# EAGLE design payload-section-B-1.1 (EAGLE 9.2.2)
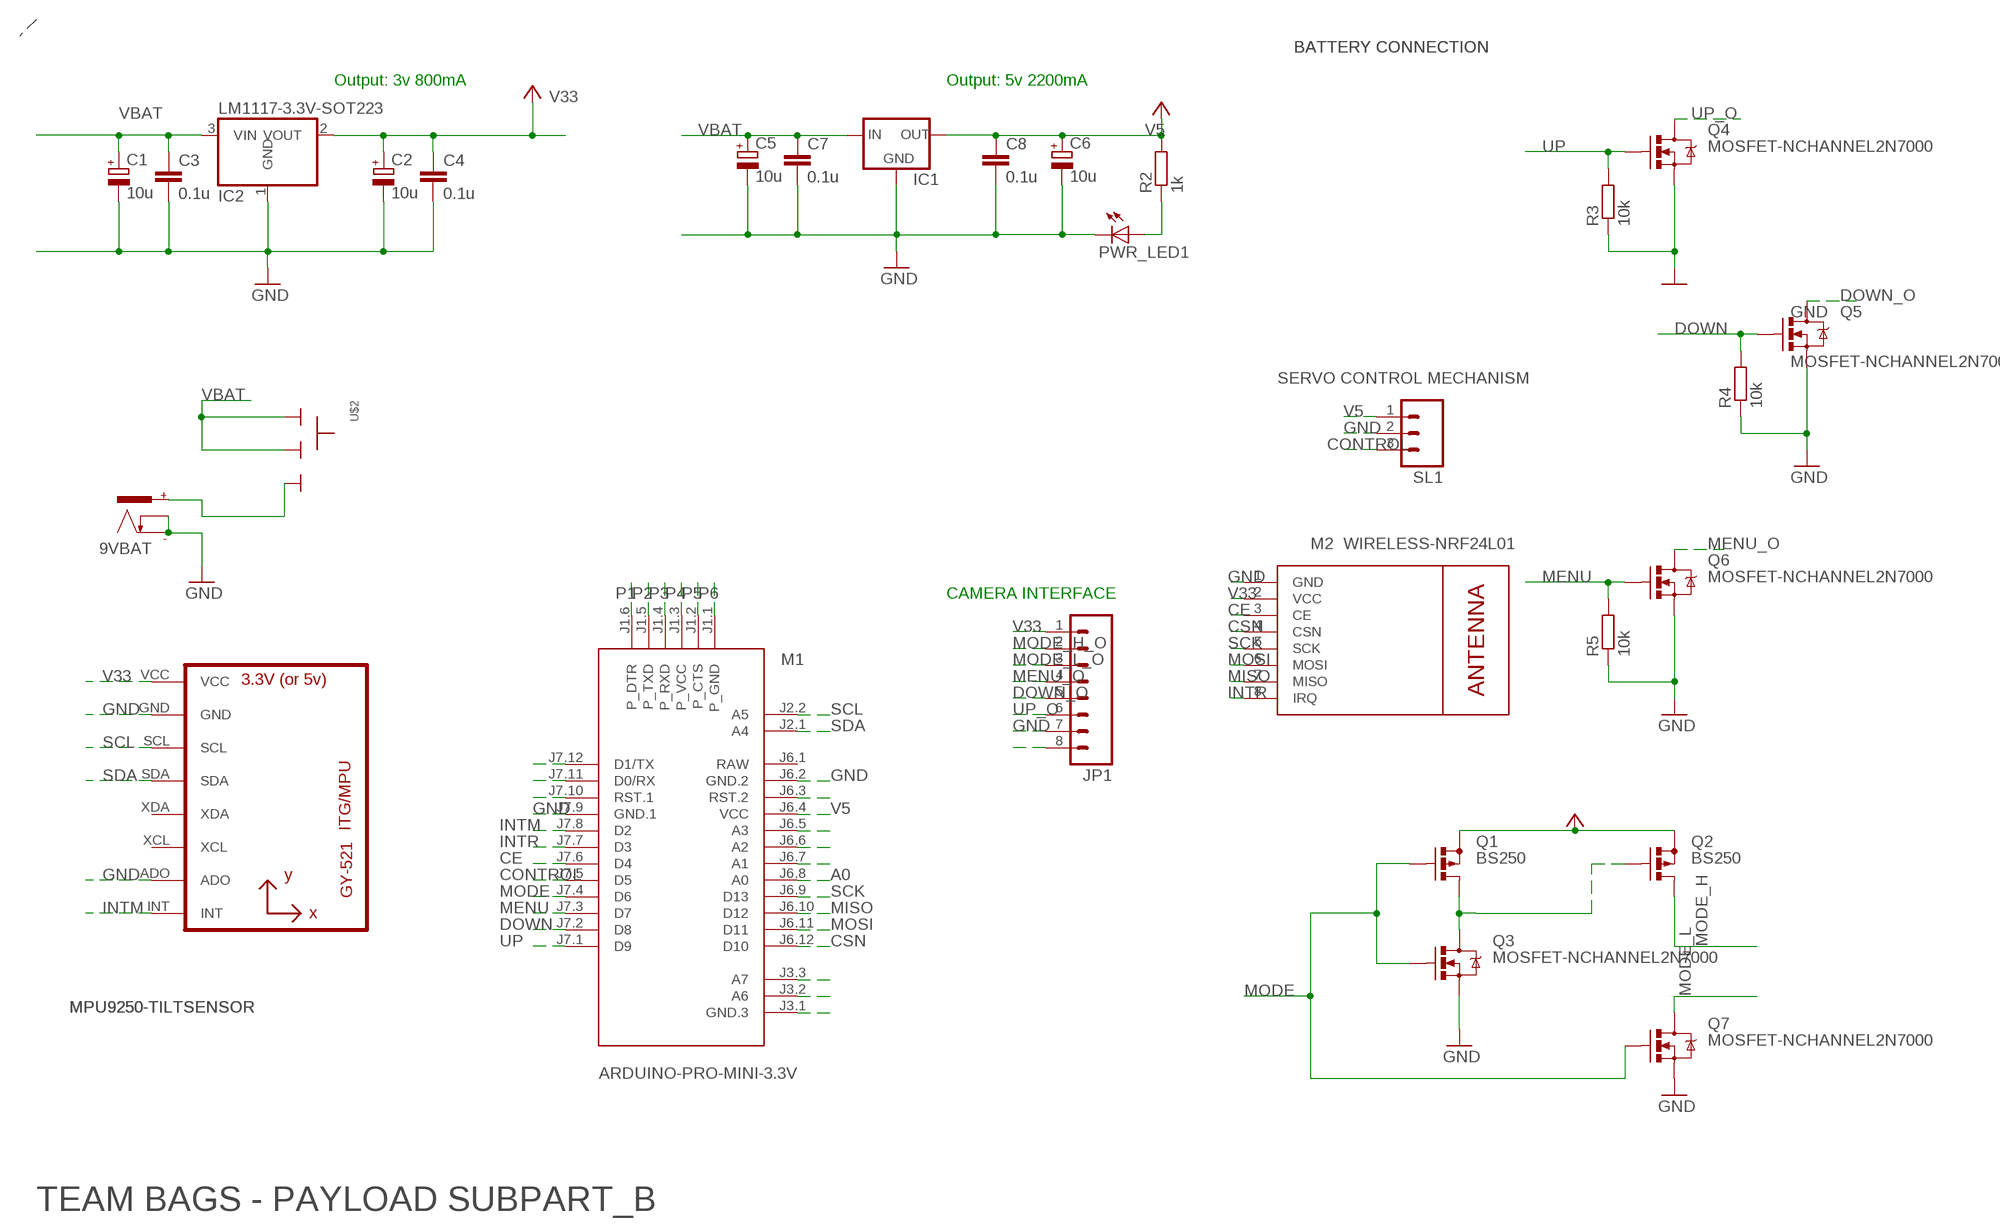
[diagram p0: schematic, sheet 1]

## Parts
9VBAT  POWER_CON  [NEB21R]
C1  10u  CPOL-EUCT6032  [CT6032]
C2  10u  CPOL-EUCT6032  [CT6032]
C3  0.1u  C-EUC0805  [C0805]
C4  0.1u  C-EUC0805  [C0805]
C5  10u  CPOL-EUCT6032  [CT6032]
C6  10u  CPOL-EUCT6032  [CT6032]
C7  0.1u  C-EUC0805  [C0805]
C8  0.1u  C-EUC0805  [C0805]
IC1  V_REG_78XX-TO-220  [TO-220-ALT]
IC2  LM1117-3.3V-SOT223  [SOT223]
JP1  M08  [08P]
M1  ARDUINO-PRO-MINI-3.3V  [ARDUINO-PRO-MINI]
M2  WIRELESS-NRF24L01  [WIRELESS-NRF24L01]
PWR_LED1  LED3MM  [LED3MM]
Q1  BS250  [SOT54E]
Q2  BS250  [SOT54E]
Q3  MOSFET-NCHANNEL2N7000  [TO-92]
Q4  MOSFET-NCHANNEL2N7000  [TO-92]
Q5  MOSFET-NCHANNEL2N7000  [TO-92]
Q6  MOSFET-NCHANNEL2N7000  [TO-92]
Q7  MOSFET-NCHANNEL2N7000  [TO-92]
R2  1k  R-EU_R0805  [R0805]
R3  10k  R-EU_R0805  [R0805]
R4  10k  R-EU_R0805  [R0805]
R5  10k  R-EU_R0805  [R0805]
SL1  M03  [03P]
U2  GY-521MPU6050  [GY-521]
U$2  SLIDESWITCH-BIG  [BIGSWITCH]

## Nets
A0: M1.J6.8(A0)
CE: M1.J7.6(D4) M2.3(CE)
CONTROL: M1.J7.5(D5) SL1.3
CSN: M1.J6.12(D10) M2.4(CSN)
DOWN: M1.J7.2(D8) Q5.2(G) R4.2
DOWN_O: JP1.5 Q5.3(D)
GND [power]: 9VBAT.- 9VBAT.C C1.- C2.- C3.2 C4.2 C5.- C6.- C7.2 C8.2 IC1.GND IC2.1(GND) JP1.7 M1.J6.2(GND.2) M1.J7.9(GND.1) M2.1(GND) PWR_LED1.K(C) Q3.1(S) Q4.1(S) Q5.1(S) Q6.1(S) Q7.1(S) R3.1 R4.1 R5.1 SL1.2 U2.ADO U2.GND
INTM: M1.J7.8(D2) U2.INT
INTR: M1.J7.7(D3) M2.8(IRQ)
MENU: M1.J7.3(D7) Q6.2(G) R5.2
MENU_O: JP1.4 Q6.3(D)
MISO: M1.J6.10(D12) M2.7(MISO)
MODE [power]: M1.J7.4(D6) Q1.G Q3.2(G) Q7.2(G)
MODE_H [power]: Q2.D
MODE_H_O [power]: JP1.2
MODE_L: Q7.3(D)
MODE_L_O: JP1.3
MOSI: M1.J6.11(D11) M2.6(MOSI)
N$1 [power_main]: 9VBAT.+ U$2.3
N$2: Q1.D Q2.G Q3.3(D)
N$4: PWR_LED1.A R2.1
N$6: M1.J6.5(A3)
N$7: M1.J6.6(A2)
N$8: M1.J6.7(A1)
N$11: JP1.8
N$15: M1.J3.3(A7)
N$16: M1.J3.2(A6)
N$17: M1.J3.1(GND.3)
N$19: M1.J6.3(RST.2)
N$22: M1.J7.12(D1/TX)
N$23: M1.J7.11(D0/RX)
N$24: M1.J7.10(RST.1)
P1: M1.J1.6(P_DTR)
P2: M1.J1.5(P_TXD)
P3: M1.J1.4(P_RXD)
P4: M1.J1.3(P_VCC)
P5: M1.J1.2(P_CTS)
P6: M1.J1.1(P_GND)
SCK: M1.J6.9(D13) M2.5(SCK)
SCL: M1.J2.2(A5) U2.SCL
SDA: M1.J2.1(A4) U2.SDA
UP: M1.J7.1(D9) Q4.2(G) R3.2
UP_O: JP1.6 Q4.3(D)
V5 [power]: C6.+ C8.1 IC1.OUT M1.J6.4(VCC) R2.2 SL1.1 ; supply symbol labelled VCC
V33 [power]: C2.+ C4.1 IC2.2(VOUT) JP1.1 M2.2(VCC) U2.VCC ; supply symbol labelled VCC
VBAT [power_main]: C1.+ C3.1 C5.+ C7.1 IC1.IN IC2.3(VIN) U$2.1 U$2.2
VCC [power]: Q1.S Q2.S
Unconnected: U2.XCL U2.XDA

## Notes on the sheet
- BATTERY CONNECTION | BATTERY CONNECTION
- Output: 3v 800mA | Output: 5v 2200mA
- SERVO CONTROL MECHANISM
- CAMERA INTERFACE
- MPU9250-TILTSENSOR | MPU9250-TILTSENSOR
- TEAM BAGS - PAYLOAD SUBPART_B

## Power pins joined to a net without a drawn wire
RAW: M1.J6.1(RAW)

## Library data of the parts
9VBAT = CEDT_JANUARY_2015_v5:POWER_CON: DC Power Connector
C1 C2 C5 C6 = rcl:CPOL-EU: POLARIZED CAPACITOR, European symbol; SPICEPREFIX: C
C3 C4 C7 C8 = rcl:C-EU: CAPACITOR, European symbol; SPICEPREFIX: C
IC1 = 1 - Jim:V_REG_78XX: Voltage Regulator Standard 7805 5V regulator. IGO (Input Ground Output). Spark Fun Electronics SKU : COM-00107
IC2 = msp framework:LM1117: LM1117 800mA Low Dropout (LDO) Positive Regulator 1.8V, 2.5V, 2.85V, 3.3V, 5V, and Adj Datasheet <www.ti.com/lit/ds/symlink/lm1117.pdf>; SUNROM: 4004
JP1 = con-amp-quick:M08: AMP QUICK CONNECTOR; OC_FARNELL: unknown; OC_NEWARK: unknown
M1 = diy-modules:ARDUINO-PRO-MINI-*: Arduino Pro Mini and compatible devices More details available here: https://www.arduino.cc/en/Main/ArduinoBoardProMini Click here to find device on ebay.com <http://www.ebay.com/sch/arduino+pro+mini>
M2 = diy-modules:WIRELESS-NRF24L01: 2.4 GHz Wireless Module based on NRF24L01 chip More details available here: http://www.electrodragon.com/w/NRF24L01 Click here to find device on ebay.com <http://www.ebay.com/sch/nrf24l01+arduino>
PWR_LED1 = 01_adafruit:LED: LED OSRAM: - CHIPLED LG R971, LG N971, LY N971, LG Q971, LY Q971, LO R971, LY R971 LH N974, LH R974 LS Q976, LO Q976, LY Q976 LO Q996 - Hyper CHIPLED LW Q18S LB Q993, LB Q99A, LB R99A - SideLED LS A670, LO A670, LY A670, LG A670, LP A670 LB A673, LV A673, LT A673, LW A673 LH A674 LY A675 LS A676, LA A676, LO A676, LY A676, LW A676 LS A679, LY A679, LG A679 - Hyper Micro SIDELED® LS Y876, LA Y876, LO Y876, LY Y876 LT Y87S - SmartLED LW L88C, LW L88S LB L89C, LB L89S, LG L890 LS L89K, LO L89K, LY L89K LS L896, LA L896, LO L896, LY L896 - TOPLED LS T670, LO T670, LY T670, LG T670, LP T670 LSG T670, LSP T670, LSY T670, LOP T670, LYG T670 LG T671, LOG T671, LSG T671 LB T673, LV T673, LT T673, LW T673 LH T674 LS T676, LA T676, LO T676, LY T676, LB T676, LH T676, LSB T676, LW T676 LB T67C, LV T67C, LT T67C, LS T67K, LO T67K, LY T67K, LW E67C LS E67B, LA E67B, LO E67B, LY E67B, LB E67C, LV E67C, LT E67C LW T67C LS T679, LY T679, LG T679 LS T770, LO T770, LY T770, LG T770, LP T770 LB T773, LV T773, LT T773, LW T773 LH T774 LS E675, LA E675, LY E675, LS T675 LS T776, LA T776, LO T776, LY T776, LB T776 LHGB T686 LT T68C, LB T68C - Hyper Mini TOPLED® LB M676 - Mini TOPLED Santana® LG M470 LS M47K, LO M47K, LY M47K Source: http://www.osram.convergy.de/
Q1 Q2 = transistor-small-signal:BS250: P-CHANNEL MOS FET
Q3-Q7 = SparkFun-DiscreteSemi:MOSFET-NCHANNEL: Common NMOSFET Parts MFG P/N Store ID Prod ID FDD8780 TRANS-09984 SI7820DN TRANS-11055 FDS6630A IC-08089 2N7002PW TRANS-11151 FQP30N06L COM-10213 TRANS-10060 BSS123LT1G TRANS-08345 BSS138 TRANS-00830 BS170 2N7000
R2-R5 = rcl:R-EU_: RESISTOR, European symbol; SPICEPREFIX: R
SL1 = con-amp-quick:M03: AMP QUICK CONNECTOR; OC_FARNELL: unknown; OC_NEWARK: unknown
U2 = gy-521:GY-521
U$2 = CEDT_JANUARY_2015_v5:SLIDESWITCH

## Net classes
0 default: width 0.305 mm, clearance 0.305 mm
1 power: width 0.61 mm, clearance 0.305 mm
2 power_main: width 0.813 mm, clearance 0.305 mm

## Board
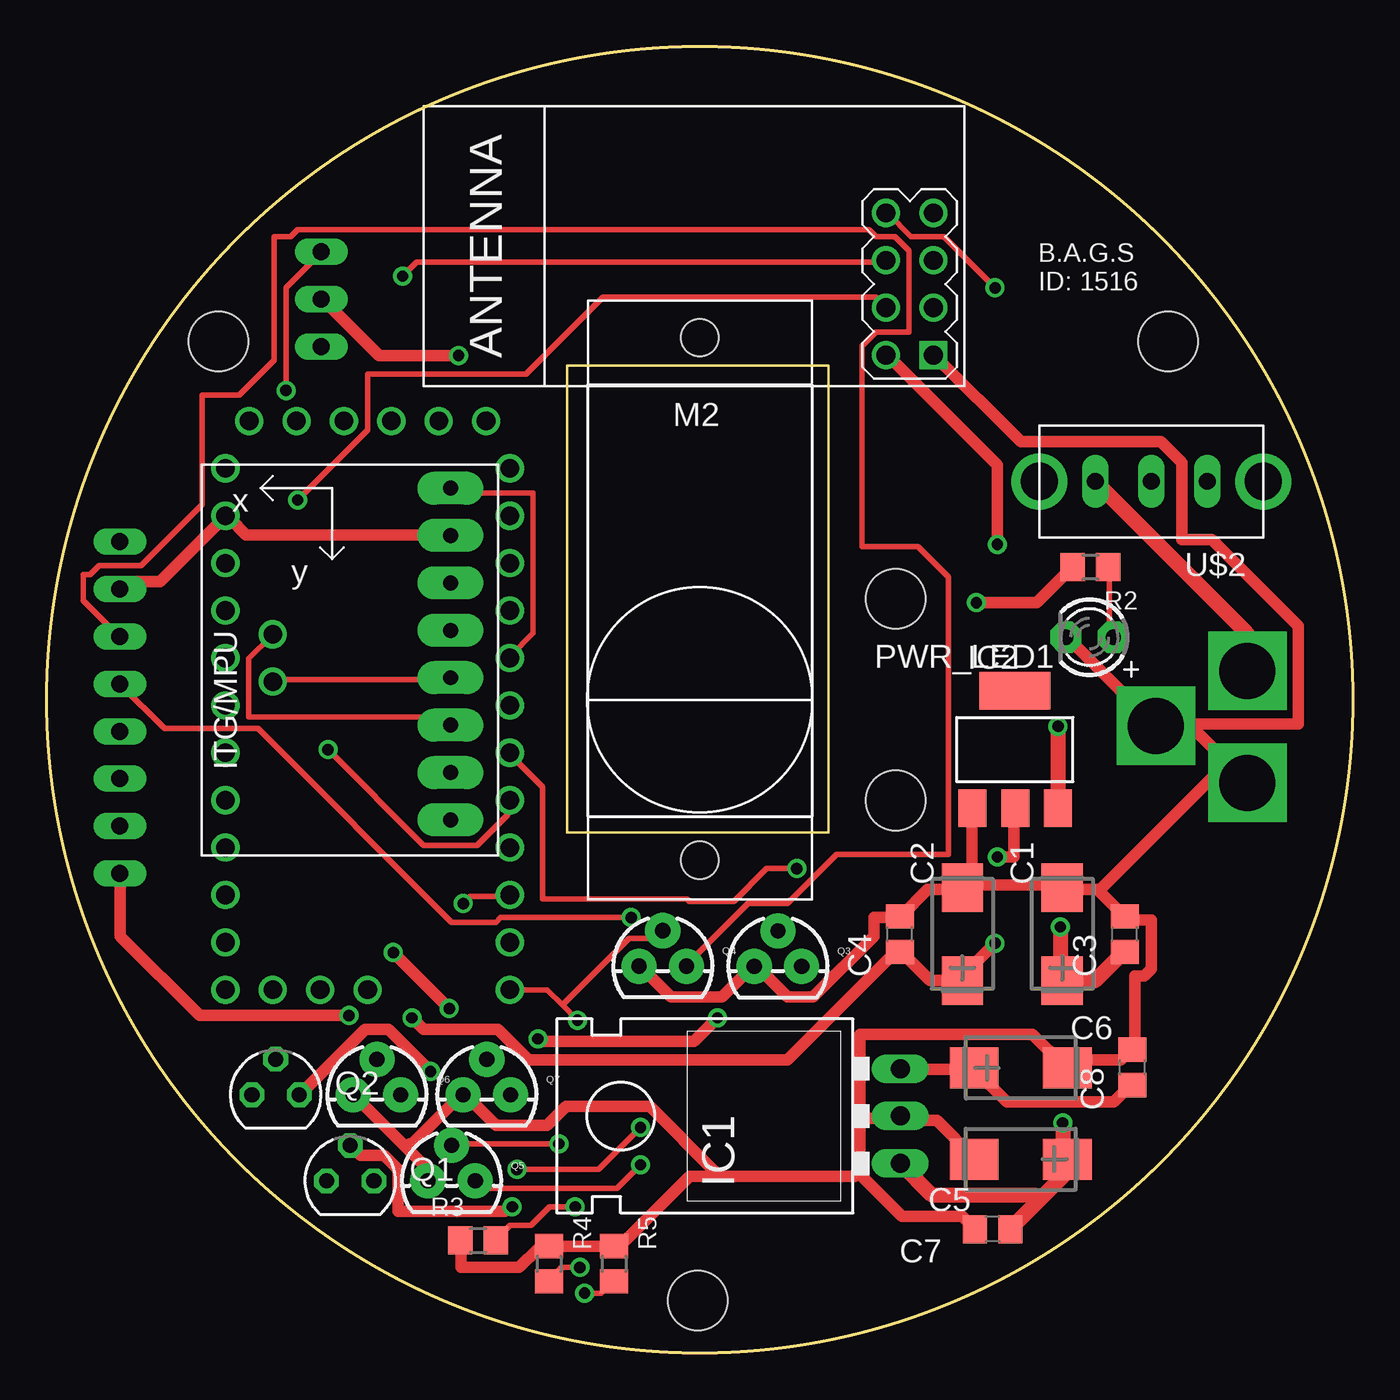
[diagram p1: board, top side]
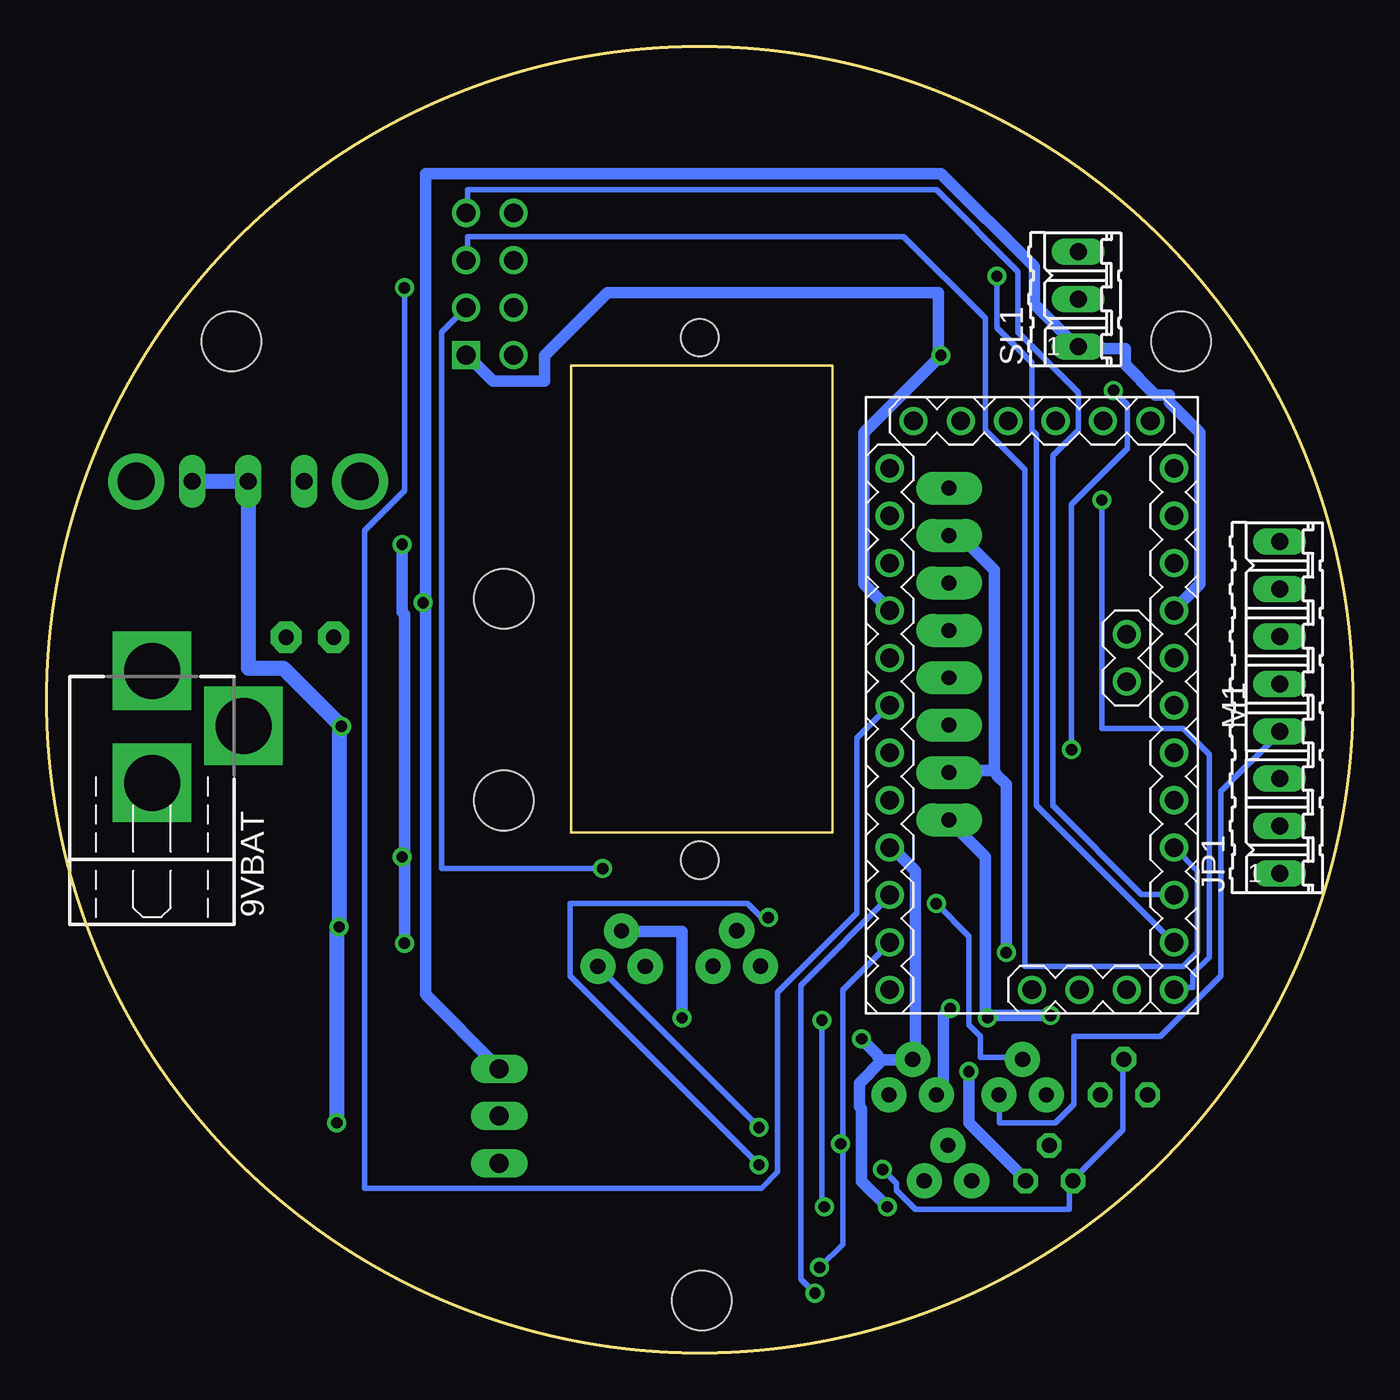
[diagram p2: board, bottom side, seen from below]

Size 70 x 70 mm. Coordinates in mm from the lower left corner, seen from the top.
Outline: circle at 35,35 radius 35
Copper layers (1*16): Top 0.035mm / dielectric 1.5mm / Bottom 0.035mm
Design rules "default": minimum track width 10mil, minimum drill 24mil, track to track 8mil, track to pad 8mil, pad to pad 8mil, via to via 8mil, smd to smd 8mil, copper to edge 40mil, drill to drill 8mil, minimum pad ring 10mil, minimum via ring 8mil, stop-mask expansion 4mil, vias tented up to drill 0mil, thermal gap 10mil
Holes 3.2 mm at 9.2,54.2 60.1,54.2 34.9,2.8 45.5,40.4 45.5,29.6

### Footprints (pad centres in the part's own frame; a part is rotated, then mirrored left to right if it is on the bottom)
NEB21R = drill 3 pad 4.2 square: + 0,3.54; - 0,-2.46; C 4.9,0.59
CT6032 = smd 2.6 x 2.2: + -2.5,0; - 2.5,0
C0805 = smd 1.3 x 1.5: 1 -0.95,0; 2 0.95,0
TO-220-ALT = drill 1.016 long: GND 0,-3.81; IN -2.54,-3.81; OUT 2.54,-3.81
SOT223 = smd 1.499 x 2.007: 1 -2.261,-3.15; 2 0.025,-3.15; 3 2.311,-3.15 | smd 3.81 x 2.007: 4 0,3.15
08P = drill 0.914 long: 1 -8.89,0; 2 -6.35,0; 3 -3.81,0; 4 -1.27,0; 5 1.27,0; 6 3.81,0; 7 6.35,0; 8 8.89,0
ARDUINO-PRO-MINI = drill 1: J1.1 -15.24,6.35; J1.2 -15.24,3.81; J1.3 -15.24,1.27; J1.4 -15.24,-1.27; J1.5 -15.24,-3.81; J1.6 -15.24,-6.35; J2.1 -1.27,5.08; J2.2 -3.81,5.08; J3.1 15.24,0; J3.2 15.24,2.54; J3.3 15.24,5.08; J6.1 -12.7,7.62; J6.2 -10.16,7.62; J6.3 -7.62,7.62; J6.4 -5.08,7.62; J6.5 -2.54,7.62; J6.6 0,7.62; J6.7 2.54,7.62; J6.8 5.08,7.62; J6.9 7.62,7.62; J6.10 10.16,7.62; J6.11 12.7,7.62; J6.12 15.24,7.62; J7.1 15.24,-7.62; J7.2 12.7,-7.62; J7.3 10.16,-7.62; J7.4 7.62,-7.62; J7.5 5.08,-7.62; J7.6 2.54,-7.62; J7.7 0,-7.62; J7.8 -2.54,-7.62; J7.9 -5.08,-7.62; J7.10 -7.62,-7.62; J7.11 -10.16,-7.62; J7.12 -12.7,-7.62
WIRELESS-NRF24L01 = drill 1 square: 1 -12.7,6.35 | drill 1: 2 -10.16,6.35; 3 -12.7,3.81; 4 -10.16,3.81; 5 -12.7,1.27; 6 -10.16,1.27; 7 -12.7,-1.27; 8 -10.16,-1.27
LED3MM = drill 0.813 pad 1.676 octagon: A -1.27,0; K 1.27,0
SOT54E = drill 0.813 octagon: D -1.27,0; G 0,1.905; S 1.27,0
TO-92 = drill 0.813 pad 1.88: 1 -1.27,0; 2 0,1.905; 3 1.27,0
R0805 = smd 1.3 x 1.5: 1 -0.95,0; 2 0.95,0
03P = drill 0.914 long: 1 -2.54,0; 2 0,0; 3 2.54,0
GY-521 = drill 0.8 pad 1.778 long: ADO -8.89,-6.35; GND -8.89,6.35; INT -8.89,-8.89; SCL -8.89,3.81; SDA -8.89,1.27; VCC -8.89,8.89; XCL -8.89,-3.81; XDA -8.89,-1.27
SG90_TOP = hole 2: 4.1,26.5; 4.1,-1.5
BIGSWITCH = drill 0.9 long: 1 -3,0; 2 0,0; 3 3,0 | drill 2 pad 2.184: TAB1 -6,0; TAB2 6,0

### Placement (x,y rotation side)
9VBAT  64.35,33.01 0 bottom
C1  54.42,22.44 90 top
C2  49.07,22.44 90 top
C3  57.77,22.44 90 top
C4  45.72,22.44 90 top
C5  52.2,10.38 180 top
C6  52.2,15.27 0 top
C7  50.7,6.63 180 top
C8  58.18,15.3 90 top
IC1  41.94,12.69 90 top
IC2  51.88,32.33 0 top
JP1  3.92,34.58 90 bottom
M1  17.2,34.7 270 bottom
M2  34.82,59.82 180 top
PWR_LED1  55.89,38.35 180 top
Q1  16.27,9.21 0 top
Q2  12.27,13.83 0 top
Q3  39.19,20.71 0 top
Q4  33.02,20.72 0 top
Q5  21.7,9.21 0 top
Q6  17.7,13.83 0 top
Q7  23.59,13.83 0 top
R2  55.93,42.1 180 top
R3  23.12,6.03 0 top
R4  26.92,4.78 270 top
R5  30.41,4.78 270 top
SL1  14.72,56.47 90 bottom
U2  12.75,37.45 180 top
U$1  [SG90_TOP]  30.9,27.9 0 top
U$2  59.2,46.7 180 top

### Tracks (layer width: path | path; a pad name or v marks a point on that pad's centre or on a via)
1
  cutout Top: 29,51.8 41,51.8 41,28.8 29,28.8
CE  (via drill 0.61)
  Top 0.305: v40.2,25.95 38.58,25.95 36.83,24.2 34.45,24.2 34.33,24.33 26.58,24.33 26.58,30.33 24.83,32.08 M1.J7.6
  Bottom 0.305: v40.2,25.95 48.83,25.95 48.83,54.7 47.58,55.95 M2.3
CONTROL  (via drill 0.61)
  Top 0.305: v12.83,51.58 12.83,57.08 14.7,58.95 SL1.3 | v15.08,32.33 20.2,27.2 23.08,27.2 24.7,28.83 24.7,29.58 M1.J7.5
  Bottom 0.305: v12.83,51.58 12.08,50.83 12.08,48.45 15.08,45.45 v15.08,32.33
CSN  (via drill 0.61)
  Top 0.305: v13.45,45.7 17.2,49.45 17.2,52.45 25.7,52.45 29.83,56.58 44.45,56.58 44.95,56.08 M2.4
  Bottom 0.305: v13.45,45.7 13.45,33.45 9.08,33.45 7.7,32.08 7.7,21.2 8.58,20.33 8.58,19.58 9.58,19.58 M1.J6.12
DOWN  (via drill 0.61)
  Top 0.305: v28.58,4.58 27.58,4.58 26.95,3.95 R4.2 | v27.45,11.2 21.7,11.2 Q5.2
  Bottom 0.305: v28.58,4.58 27.33,5.83 27.33,11.2 | 27.33,11.2 27.33,19.45 24.83,21.95 M1.J7.2 | v27.45,11.2 27.33,11.2
DOWN_O  (via drill 0.61)
  Top 0.305: v31.33,23.33 24.33,23.33 24.08,23.08 21.7,23.08 11.33,33.45 6.33,33.45 3.95,35.83 JP1.5 | v31.83,10.08 30.58,8.83 23.45,8.83 23.08,9.2 Q5.3
  Bottom 0.305: v31.33,23.33 31.7,23.33 32.45,24.08 41.95,24.08 41.95,20.2 v31.83,10.08
GND  (via drill 0.61)
  Top 0.61: JP1.7 3.95,40.95 4.33,41.33 6.08,41.33 9.58,44.83 M1.J6.2 9.83,44.7 10.7,43.83 21.58,43.83 U2.ADO | 19.26,11.01 20.33,9.95 20.33,9.33 Q5.1 | 19.26,11.01 16.45,13.83 Q6.1 | 19.26,11.01 19.45,11.2 19.58,11.2 22.2,13.83 Q7.1 22.58,13.7 24.08,12.2 26.83,12.2 27.83,13.2 32.33,13.2 35.83,9.7 35.83,9.45 | R3.1 22.2,5.95 22.2,4.58 25.33,4.58 26.33,5.58 26.7,5.58 R4.1 26.95,5.7 30.33,5.7 R5.1 30.7,5.7 34.45,9.45 35.83,9.45 | 43.58,9.58 45.83,7.33 49.08,7.33 49.7,6.7 C7.2 | 43.58,12.58 43.58,9.58 | 43.58,12.58 45.7,12.58 IC1.GND 45.95,12.45 47.7,12.45 49.7,10.45 C5.- | 35.83,9.45 43.33,9.45 43.58,9.58 | v21.58,18.45 v18.58,21.45 | v22.08,53.45 17.83,53.45 14.83,56.45 SL1.2 | PWR_LED1.K 54.7,38.33 59.33,33.7 59.45,33.7 9VBAT.C 59.7,33.45 61.45,33.45 | 61.45,33.45 9VBAT.- 63.08,31.45 56.39,24.76 | Q4.1 31.83,20.7 33.45,19.08 36.2,19.08 37.83,20.7 Q3.1 38.2,20.58 39.7,19.08 41.08,19.08 44.33,22.33 44.33,23.33 45.45,23.33 C4.2 45.83,23.45 47.2,24.83 48.95,24.83 C2.- | IC2.1 49.58,29.08 49.58,25.2 49.2,25.2 C2.- | 56.39,24.76 56.33,24.83 54.45,24.83 C1.- 54.2,25.08 49.83,25.08 C2.- | 56.39,24.76 57.7,23.45 C3.2 57.95,23.2 59.2,23.2 59.2,20.58 58.83,20.2 58.33,20.2 58.33,16.45 C8.2 58.08,16.2 57.58,15.7 55.08,15.7 54.7,15.33 C6.- 54.45,15.45 52.83,17.08 43.58,17.08 43.58,12.58 | M2.1 47.58,53.45 52.2,48.83 59.7,48.83 60.83,47.7 60.83,43.58 62.45,43.58 67.08,38.95 67.08,33.7 61.58,33.7 61.45,33.45
  Bottom 0.61: 19.2,31.2 21.58,31.2 U2.GND | 19.2,31.2 19.2,41.95 20.95,43.7 21.58,43.7 U2.ADO | v18.58,21.45 18.58,30.45 19.08,30.95 19.2,31.2 | v21.58,18.45 21.95,18.08 21.95,14.2 Q7.1 | M1.J7.9 24.83,39.83 26.2,41.2 26.2,49.33 v22.08,53.45 22.2,53.7 22.2,56.83 39.95,56.83 43.33,53.45 43.33,52.08 46.08,52.08 47.45,53.45 M2.1
INTM
  Top 0.305: M1.J7.8 24.83,37.33 26.08,38.58 26.08,46.08 21.95,46.08 21.7,46.33 U2.INT
INTR  (via drill 0.61)
  Top 0.305: v50.83,57.08 48.08,59.83 46.33,59.83 45.08,61.08 M2.8
  Bottom 0.305: v50.83,57.08 50.83,46.2 52.95,44.08 52.95,8.83 31.7,8.83 30.83,9.7 30.83,19.33 26.58,23.58 26.58,32.95 M1.J7.7
MENU  (via drill 0.61)
  Top 0.305: v28.83,3.2 29.7,3.2 30.33,3.83 R5.2 | v22.33,24.08 22.7,24.45 24.7,24.45 M1.J7.3
  Bottom 0.305: v28.83,3.2 29.58,3.95 29.58,19.7 24.83,24.45 M1.J7.3 | v22.33,24.08 20.58,22.33 20.58,17.58 19.95,16.95 19.95,15.83 17.7,15.83 Q6.2
MENU_O
  Bottom 0.305: JP1.4 3.95,33.2 7.08,30.08 7.08,20.2 10.33,16.95 14.95,16.95 14.95,13.33 15.95,12.33 18.95,12.33 18.95,13.83 Q6.3
MISO
  Bottom 0.305: M1.J6.10 9.7,24.58 11.33,24.58 16.08,29.33 16.08,48.08 14.7,49.45 14.7,51.45 17.95,54.7 17.95,57.95 22.33,62.33 47.45,62.33 47.45,61.2 M2.7
MODE  (via drill 0.61)
  Top 0.61: v24.95,7.83 24.83,7.83 24.58,7.58 18.83,7.58 18.83,9.83 18.08,10.58 16.83,10.58 16.33,11.08 Q1.G | v35.95,17.95 34.7,16.7 26.45,16.7 v26.33,16.83
  Bottom 0.61: v24.95,7.83 26.33,9.2 26.33,13.08 26.45,13.2 26.45,14.45 25.26,15.64 | 25.26,15.64 25.2,15.7 23.7,15.7 Q7.2 23.45,15.95 23.45,25.83 24.7,27.08 M1.J7.4 | v35.95,17.95 35.95,22.58 39.08,22.58 Q3.2 | v26.33,16.83 25.45,15.95 25.45,15.83 25.26,15.64
MOSI  (via drill 0.61)
  Top 0.305: v19.08,57.7 19.83,58.45 44.95,58.45 M2.6
  Bottom 0.305: v19.08,57.7 19.08,54.95 17.2,53.08 17.2,49.45 16.95,49.2 16.95,29.33 9.7,22.08 M1.J6.11
N$1
  Top 0.813: U$2.3 64.33,38.58 64.33,36.58 9VBAT.+
N$2  (via drill 0.61)
  Top 0.305: v31.83,12.08 29.58,9.83 v25.2,9.83
  Bottom 0.305: Q2.G 12.33,15.7 12.33,11.95 14.95,9.33 Q1.D 14.95,9.08 15.2,8.83 15.2,7.7 23.45,7.7 24.45,8.7 24.45,9.08 v25.2,9.83 | v31.83,12.08 Q3.3
N$4
  Top 0.305: R2.1 56.95,42.08 56.95,38.45 57.08,38.45 PWR_LED1.A
SCK
  Bottom 0.305: M1.J6.9 8.33,25.83 8.33,21.45 9.08,20.7 17.58,20.7 17.58,47.33 19.7,49.45 19.7,55.45 24.08,59.83 47.45,59.83 47.45,58.58 M2.5
SCL
  Top 0.305: M1.J2.2 12.08,38.45 10.83,37.2 10.83,34.08 21.2,34.08 21.58,33.7 U2.SCL
SDA
  Top 0.305: M1.J2.1 12.2,36.08 21.58,36.08 U2.SDA
UP  (via drill 0.61)
  Top 0.305: v28.33,7.83 26.95,7.83 25.95,6.83 24.83,6.83 24.08,6.08 R3.2 | 27.64,18.64 26.83,19.45 M1.J7.1 | 27.64,18.64 v28.45,17.83 | 27.64,18.64 31.2,22.2 32.58,22.2 32.95,22.58 Q4.2
  Bottom 0.305: v28.33,7.83 28.45,7.95 v28.45,17.83
UP_O
  Top 0.305: JP1.6 3.83,38.45 1.95,40.33 1.95,41.7 2.33,41.7 2.83,42.2 5.08,42.2 8.33,45.45 8.33,51.33 10.33,51.33 12.2,53.2 12.2,59.83 13.08,59.83 13.45,60.2 44.08,60.2 44.45,59.83 45.45,59.83 46.2,59.08 46.2,54.7 44.45,54.7 43.7,53.95 43.7,43.2 46.7,43.2 48.33,41.58 48.33,26.7 42.33,26.7 39.7,24.08 37.58,24.08 34.33,20.83 Q4.3
V5  (via drill 0.61)
  Top 0.61: C8.1 58.08,14.33 57.2,13.45 51.45,13.45 49.7,15.2 C6.+ 49.45,15.2 45.83,15.2 IC1.OUT | v49.83,40.2 53.08,40.2 54.95,42.08 R2.2
  Bottom 0.61: M1.J6.4 9.58,39.83 8.2,41.2 8.2,49.33 9.83,50.95 9.83,51.33 10.58,51.33 12.2,52.95 12.2,53.83 14.7,53.83 SL1.1 14.95,54.08 17.08,56.2 17.08,58.2 22.08,63.2 49.7,63.2 49.7,40.45 v49.83,40.2 49.7,40.08 49.7,19.2 45.83,15.33 IC1.OUT
V33  (via drill 0.61)
  Top 0.61: v16.2,18.08 8.2,18.08 3.95,22.33 3.95,25.58 JP1.1 | v50.95,26.58 51.83,26.58 51.83,29.08 IC2.2 | v50.83,21.95 49.08,20.2 C2.+ 48.95,19.95 47.33,19.95 45.83,21.45 C4.1 45.45,21.45 39.7,15.7 25.83,15.7 24.2,17.33 20.2,17.33 v19.58,17.95 | v50.95,43.33 50.95,47.58 45.08,53.45 M2.2
  Bottom 0.61: 19.58,18.08 19.7,18.08 19.7,26.58 21.58,28.45 U2.VCC | 19.58,18.08 v16.2,18.08 | v50.83,21.95 50.83,26.45 v50.95,26.58 50.83,26.83 50.83,39.58 50.95,39.7 v50.95,43.33 | v19.58,17.95 19.58,18.08
VBAT  (via drill 0.61)
  Top 0.813: 53.2,8.2 54.7,9.7 C5.+ 54.45,10.7 v54.45,12.33 | 53.2,8.2 51.7,6.7 C7.1 | IC1.IN 47.45,8.45 52.95,8.45 53.2,8.2 | C3.1 57.7,21.45 56.2,19.95 54.45,19.95 C1.+ 54.33,20.33 v54.33,22.83 | v54.2,33.58 54.2,29.2 IC2.3
  Bottom 0.813: U$2.1 U$2.2 59.2,36.7 57.33,36.7 v54.2,33.58 54.33,33.2 v54.33,22.83 54.45,22.45 v54.45,12.33
VCC  (via drill 0.61)
  Top 0.61: v20.58,15.08 18.33,17.33 17.08,17.33 13.7,13.95 13.58,13.95 Q2.S
  Bottom 0.61: v20.58,15.08 20.58,12.33 17.58,9.33 Q1.S

### Text on the board
tPlace: B.A.G.S / ID: 1516